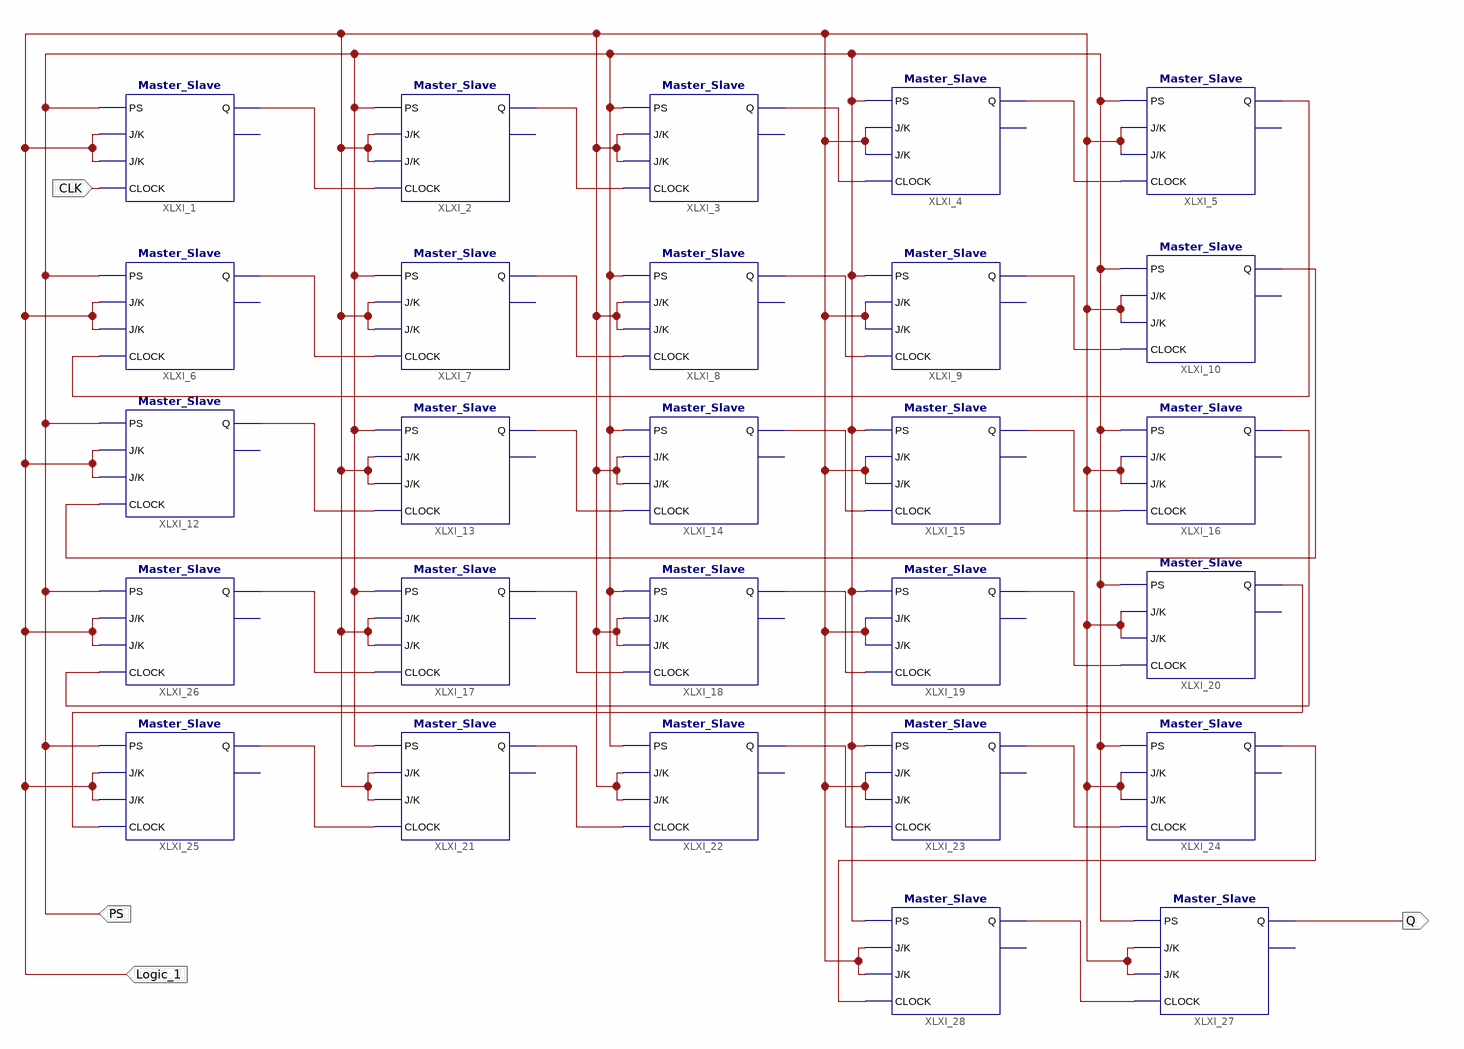
[diagram p0: schematic sheet 1]
// Xilinx ISE schematic BlackBox.sch (artix7) as structural Verilog: 27 symbols, 4 ports
module BlackBox (
  input  Logic_1,
  input  PS,
  input  CLK,
  output Q
);

  wire XLXN_11, XLXN_12, XLXN_13, XLXN_14, XLXN_16, XLXN_17, XLXN_18, XLXN_19, XLXN_21, XLXN_22, XLXN_23,
       XLXN_24, XLXN_25, XLXN_26, XLXN_27, XLXN_28, XLXN_29, XLXN_30, XLXN_31, XLXN_32, XLXN_33, XLXN_34,
       XLXN_35, XLXN_78, XLXN_86, XLXN_87;

  Master_Slave XLXI_1 (.CLOCK(CLK), .J(Logic_1), .K(Logic_1), .PS(PS), .Q(XLXN_11));  // open: Qb
  Master_Slave XLXI_2 (.CLOCK(XLXN_11), .J(Logic_1), .K(Logic_1), .PS(PS), .Q(XLXN_12));  // open: Qb
  Master_Slave XLXI_3 (.CLOCK(XLXN_12), .J(Logic_1), .K(Logic_1), .PS(PS), .Q(XLXN_13));  // open: Qb
  Master_Slave XLXI_4 (.CLOCK(XLXN_13), .J(Logic_1), .K(Logic_1), .PS(PS), .Q(XLXN_14));  // open: Qb
  Master_Slave XLXI_5 (.CLOCK(XLXN_14), .J(Logic_1), .K(Logic_1), .PS(PS), .Q(XLXN_78));  // open: Qb
  Master_Slave XLXI_6 (.CLOCK(XLXN_78), .J(Logic_1), .K(Logic_1), .PS(PS), .Q(XLXN_16));  // open: Qb
  Master_Slave XLXI_7 (.CLOCK(XLXN_16), .J(Logic_1), .K(Logic_1), .PS(PS), .Q(XLXN_17));  // open: Qb
  Master_Slave XLXI_8 (.CLOCK(XLXN_17), .J(Logic_1), .K(Logic_1), .PS(PS), .Q(XLXN_18));  // open: Qb
  Master_Slave XLXI_9 (.CLOCK(XLXN_18), .J(Logic_1), .K(Logic_1), .PS(PS), .Q(XLXN_19));  // open: Qb
  Master_Slave XLXI_10 (.CLOCK(XLXN_19), .J(Logic_1), .K(Logic_1), .PS(PS), .Q(XLXN_21));  // open: Qb
  Master_Slave XLXI_12 (.CLOCK(XLXN_21), .J(Logic_1), .K(Logic_1), .PS(PS), .Q(XLXN_22));  // open: Qb
  Master_Slave XLXI_13 (.CLOCK(XLXN_22), .J(Logic_1), .K(Logic_1), .PS(PS), .Q(XLXN_23));  // open: Qb
  Master_Slave XLXI_14 (.CLOCK(XLXN_23), .J(Logic_1), .K(Logic_1), .PS(PS), .Q(XLXN_24));  // open: Qb
  Master_Slave XLXI_15 (.CLOCK(XLXN_24), .J(Logic_1), .K(Logic_1), .PS(PS), .Q(XLXN_25));  // open: Qb
  Master_Slave XLXI_16 (.CLOCK(XLXN_25), .J(Logic_1), .K(Logic_1), .PS(PS), .Q(XLXN_26));  // open: Qb
  Master_Slave XLXI_17 (.CLOCK(XLXN_27), .J(Logic_1), .K(Logic_1), .PS(PS), .Q(XLXN_28));  // open: Qb
  Master_Slave XLXI_18 (.CLOCK(XLXN_28), .J(Logic_1), .K(Logic_1), .PS(PS), .Q(XLXN_29));  // open: Qb
  Master_Slave XLXI_19 (.CLOCK(XLXN_29), .J(Logic_1), .K(Logic_1), .PS(PS), .Q(XLXN_30));  // open: Qb
  Master_Slave XLXI_20 (.CLOCK(XLXN_30), .J(Logic_1), .K(Logic_1), .PS(PS), .Q(XLXN_31));  // open: Qb
  Master_Slave XLXI_21 (.CLOCK(XLXN_32), .J(Logic_1), .K(Logic_1), .PS(PS), .Q(XLXN_33));  // open: Qb
  Master_Slave XLXI_22 (.CLOCK(XLXN_33), .J(Logic_1), .K(Logic_1), .PS(PS), .Q(XLXN_34));  // open: Qb
  Master_Slave XLXI_23 (.CLOCK(XLXN_34), .J(Logic_1), .K(Logic_1), .PS(PS), .Q(XLXN_35));  // open: Qb
  Master_Slave XLXI_24 (.CLOCK(XLXN_35), .J(Logic_1), .K(Logic_1), .PS(PS), .Q(XLXN_86));  // open: Qb
  Master_Slave XLXI_25 (.CLOCK(XLXN_31), .J(Logic_1), .K(Logic_1), .PS(PS), .Q(XLXN_32));  // open: Qb
  Master_Slave XLXI_26 (.CLOCK(XLXN_26), .J(Logic_1), .K(Logic_1), .PS(PS), .Q(XLXN_27));  // open: Qb
  Master_Slave XLXI_27 (.CLOCK(XLXN_87), .J(Logic_1), .K(Logic_1), .PS(PS), .Q(Q));  // open: Qb
  Master_Slave XLXI_28 (.CLOCK(XLXN_86), .J(Logic_1), .K(Logic_1), .PS(PS), .Q(XLXN_87));  // open: Qb
endmodule
